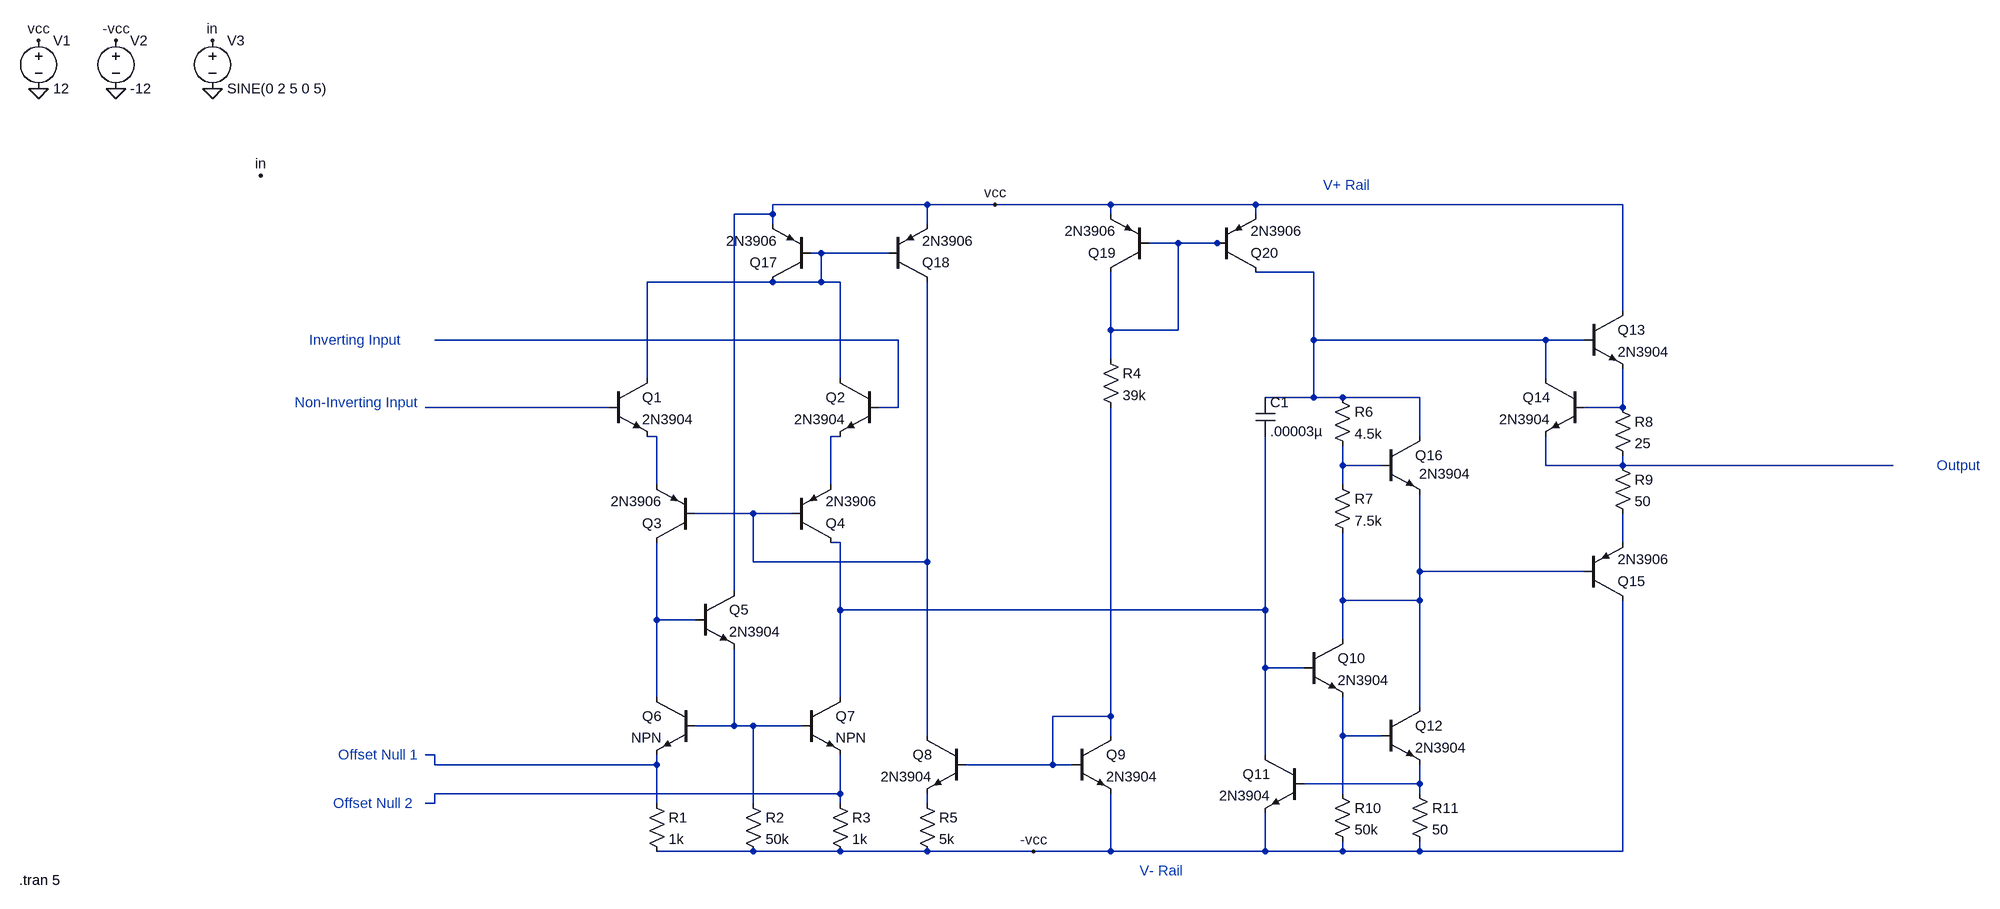
[diagram p0: schematic SevenFortyFun Simulation.asc]
SevenFortyFun Simulation.asc, the LTspice schematic file:
Version 4
SHEET 1 2084 680
WIRE 320 -544 64 -544
WIRE 432 -544 320 -544
WIRE 624 -544 432 -544
WIRE 864 -544 624 -544
WIRE 1472 -544 864 -544
WIRE 64 -528 64 -544
WIRE 64 -528 0 -528
WIRE 624 -528 624 -544
WIRE 864 -528 864 -544
WIRE 64 -512 64 -528
WIRE 320 -512 320 -544
WIRE 736 -480 688 -480
WIRE 800 -480 736 -480
WIRE 816 -480 800 -480
WIRE 144 -464 128 -464
WIRE 256 -464 144 -464
WIRE 960 -432 864 -432
WIRE 64 -416 -144 -416
WIRE 144 -416 144 -464
WIRE 144 -416 64 -416
WIRE 176 -416 144 -416
WIRE 1472 -368 1472 -544
WIRE 624 -336 624 -432
WIRE 736 -336 736 -480
WIRE 736 -336 624 -336
WIRE 272 -320 -496 -320
WIRE 960 -320 960 -432
WIRE 1344 -320 960 -320
WIRE 1408 -320 1344 -320
WIRE 624 -288 624 -336
WIRE -144 -256 -144 -416
WIRE 176 -256 176 -416
WIRE 1344 -256 1344 -320
WIRE 960 -224 960 -320
WIRE 960 -224 880 -224
WIRE 1008 -224 960 -224
WIRE 1136 -224 1008 -224
WIRE -208 -208 -512 -208
WIRE 272 -208 272 -320
WIRE 272 -208 240 -208
WIRE 1472 -208 1472 -272
WIRE 1472 -208 1408 -208
WIRE -128 -160 -144 -160
WIRE 176 -160 160 -160
WIRE 1136 -160 1136 -224
WIRE 1008 -112 1008 -144
WIRE 1072 -112 1008 -112
WIRE 1344 -112 1344 -160
WIRE 1472 -112 1472 -128
WIRE 1472 -112 1344 -112
WIRE 1920 -112 1472 -112
WIRE -128 -80 -128 -160
WIRE 160 -80 160 -160
WIRE 1008 -80 1008 -112
WIRE 32 -32 -64 -32
WIRE 96 -32 32 -32
WIRE 176 16 160 16
WIRE 1472 16 1472 -32
WIRE 32 48 32 -32
WIRE 320 48 320 -416
WIRE 320 48 32 48
WIRE 1136 64 1136 -64
WIRE 1408 64 1136 64
WIRE 0 96 0 -528
WIRE 1008 112 1008 0
WIRE 1136 112 1136 64
WIRE 1136 112 1008 112
WIRE 176 128 176 16
WIRE 880 128 880 -160
WIRE 880 128 176 128
WIRE -128 144 -128 16
WIRE -64 144 -128 144
WIRE 1008 176 1008 112
WIRE 880 224 880 128
WIRE 944 224 880 224
WIRE -128 272 -128 144
WIRE 176 272 176 128
WIRE 1136 288 1136 112
WIRE 624 304 624 -208
WIRE 624 304 528 304
WIRE 0 320 0 192
WIRE 0 320 -64 320
WIRE 32 320 0 320
WIRE 112 320 32 320
WIRE 320 336 320 48
WIRE 624 336 624 304
WIRE 1008 336 1008 272
WIRE 1072 336 1008 336
WIRE -496 368 -512 368
WIRE 880 368 880 224
WIRE -496 384 -496 368
WIRE -128 384 -128 368
WIRE -128 384 -496 384
WIRE 528 384 528 304
WIRE 528 384 384 384
WIRE 560 384 528 384
WIRE 1136 416 1136 384
WIRE 1136 416 944 416
WIRE 176 432 176 368
WIRE 176 432 -496 432
WIRE 1008 432 1008 336
WIRE 1136 432 1136 416
WIRE -496 448 -496 432
WIRE -496 448 -512 448
WIRE -128 448 -128 384
WIRE 32 448 32 320
WIRE 176 448 176 432
WIRE 320 448 320 432
WIRE 32 528 -128 528
WIRE 176 528 32 528
WIRE 320 528 176 528
WIRE 496 528 320 528
WIRE 624 528 624 432
WIRE 624 528 496 528
WIRE 880 528 880 464
WIRE 880 528 624 528
WIRE 1008 528 1008 512
WIRE 1008 528 880 528
WIRE 1136 528 1136 512
WIRE 1136 528 1008 528
WIRE 1472 528 1472 112
WIRE 1472 528 1136 528
FLAG -1152 -736 0
FLAG -1024 -736 0
FLAG -864 -736 0
FLAG -1152 -816 vcc
FLAG -1024 -816 -vcc
FLAG -864 -816 in
FLAG 432 -544 vcc
FLAG 496 528 -vcc
FLAG -784 -592 in
SYMBOL npn -208 -256 R0
SYMATTR InstName Q1
SYMATTR Value 2N3904
SYMBOL npn 240 -256 M0
SYMATTR InstName Q2
SYMATTR Value 2N3904
SYMBOL npn -64 272 M0
SYMATTR InstName Q6
SYMBOL npn 112 272 R0
SYMATTR InstName Q7
SYMBOL npn -64 96 R0
SYMATTR InstName Q5
SYMATTR Value 2N3904
SYMBOL npn 560 336 R0
SYMATTR InstName Q9
SYMATTR Value 2N3904
SYMBOL npn 384 336 M0
SYMATTR InstName Q8
SYMATTR Value 2N3904
SYMBOL npn 944 368 M0
SYMATTR InstName Q11
SYMATTR Value 2N3904
SYMBOL npn 944 176 R0
SYMATTR InstName Q10
SYMATTR Value 2N3904
SYMBOL npn 1072 288 R0
SYMATTR InstName Q12
SYMATTR Value 2N3904
SYMBOL npn 1072 -160 R0
WINDOW 3 63 62 Left 2
SYMATTR Value 2N3904
SYMATTR InstName Q16
SYMBOL npn 1408 -256 M0
SYMATTR InstName Q14
SYMATTR Value 2N3904
SYMBOL npn 1408 -368 R0
SYMATTR InstName Q13
SYMATTR Value 2N3904
SYMBOL pnp 96 16 M180
SYMATTR InstName Q4
SYMATTR Value 2N3906
SYMBOL pnp -64 16 R180
SYMATTR InstName Q3
SYMATTR Value 2N3906
SYMBOL pnp 128 -416 R180
SYMATTR InstName Q17
SYMATTR Value 2N3906
SYMBOL pnp 256 -416 M180
SYMATTR InstName Q18
SYMATTR Value 2N3906
SYMBOL pnp 688 -432 R180
SYMATTR InstName Q19
SYMATTR Value 2N3906
SYMBOL pnp 800 -432 M180
SYMATTR InstName Q20
SYMATTR Value 2N3906
SYMBOL pnp 1408 112 M180
SYMATTR InstName Q15
SYMATTR Value 2N3906
SYMBOL res -144 432 R0
SYMATTR InstName R1
SYMATTR Value 1k
SYMBOL res 16 432 R0
SYMATTR InstName R2
SYMATTR Value 50k
SYMBOL res 160 432 R0
SYMATTR InstName R3
SYMATTR Value 1k
SYMBOL res 608 -304 R0
SYMATTR InstName R4
SYMATTR Value 39k
SYMBOL res 304 432 R0
SYMATTR InstName R5
SYMATTR Value 5k
SYMBOL cap 864 -224 R0
SYMATTR InstName C1
SYMATTR Value .00003µ
SYMBOL res 992 -240 R0
SYMATTR InstName R6
SYMATTR Value 4.5k
SYMBOL res 992 -96 R0
SYMATTR InstName R7
SYMATTR Value 7.5k
SYMBOL res 1456 -224 R0
SYMATTR InstName R8
SYMATTR Value 25
SYMBOL res 1456 -128 R0
SYMATTR InstName R9
SYMATTR Value 50
SYMBOL res 992 416 R0
SYMATTR InstName R10
SYMATTR Value 50k
SYMBOL res 1120 416 R0
SYMATTR InstName R11
SYMATTR Value 50
SYMBOL voltage -1152 -832 R0
WINDOW 123 0 0 Left 2
WINDOW 39 0 0 Left 2
SYMATTR InstName V1
SYMATTR Value 12
SYMBOL voltage -1024 -832 R0
WINDOW 123 0 0 Left 2
WINDOW 39 0 0 Left 2
SYMATTR InstName V2
SYMATTR Value -12
SYMBOL voltage -864 -832 R0
WINDOW 123 0 0 Left 2
WINDOW 39 0 0 Left 2
SYMATTR InstName V3
SYMATTR Value SINE(0 2 5 0 5)
TEXT -704 -320 Left 2 ;Inverting Input
TEXT -728 -216 Left 2 ;Non-Inverting Input
TEXT -1184 576 Left 2 !.tran 5
TEXT 1992 -112 Left 2 ;Output
TEXT 976 -576 Left 2 ;V+ Rail
TEXT 672 560 Left 2 ;V- Rail
TEXT -656 368 Left 2 ;Offset Null 1
TEXT -664 448 Left 2 ;Offset Null 2

The netlist it stands for:
* SevenFortyFun Simulation.asc
Q1 N002 N005 N007 0 2N3904
Q2 N002 N004 N008 0 2N3904
Q6 N015 N017 N019 0 NPN
Q7 N012 N017 N021 0 NPN
Q5 vcc N015 N017 0 2N3904
Q9 N016 N016 -vcc 0 2N3904
Q8 N011 N016 N022 0 2N3904
Q11 N012 N020 -vcc 0 2N3904
Q10 N014 N012 N018 0 2N3904
Q12 N014 N018 N020 0 2N3904
Q16 N003 N009 N014 0 2N3904
Q14 N003 N006 N010 0 2N3904
Q13 vcc N003 N006 0 2N3904
Q4 N012 N011 N008 0 2N3906
Q3 N015 N011 N007 0 2N3906
Q17 N002 N002 vcc 0 2N3906
Q18 N011 N002 vcc 0 2N3906
Q19 N001 N001 vcc 0 2N3906
Q20 N003 N001 vcc 0 2N3906
Q15 -vcc N014 N013 0 2N3906
R1 N019 -vcc 1k
R2 N017 -vcc 50k
R3 N021 -vcc 1k
R4 N001 N016 39k
R5 N022 -vcc 5k
C1 N003 N012 .00003µ
R6 N003 N009 4.5k
R7 N009 N014 7.5k
R8 N006 N010 25
R9 N010 N013 50
R10 N018 -vcc 50k
R11 N020 -vcc 50
V1 vcc 0 12
V2 -vcc 0 -12
V3 in 0 SINE(0 2 5 0 5)
.model NPN NPN
.model PNP PNP
.lib standard.bjt
* Inverting Input
* Non-Inverting Input
.tran 5
* Output
* V+ Rail
* V- Rail
* Offset Null 1
* Offset Null 2
.backanno
.end